# EasyEDA Pro project DreamFly.eprj, schematic Schematic2
Board Name: Board2; Create Date: 2024-09-10; Page Name: DreamFly RemoteControl; Project Name: DreamFly; Schematic Name: Schematic2; Update Date: 2024-12-20; Company: 嘉立创EDA; Drawed: 梅雨; Page Size: A4; Version: V1.0
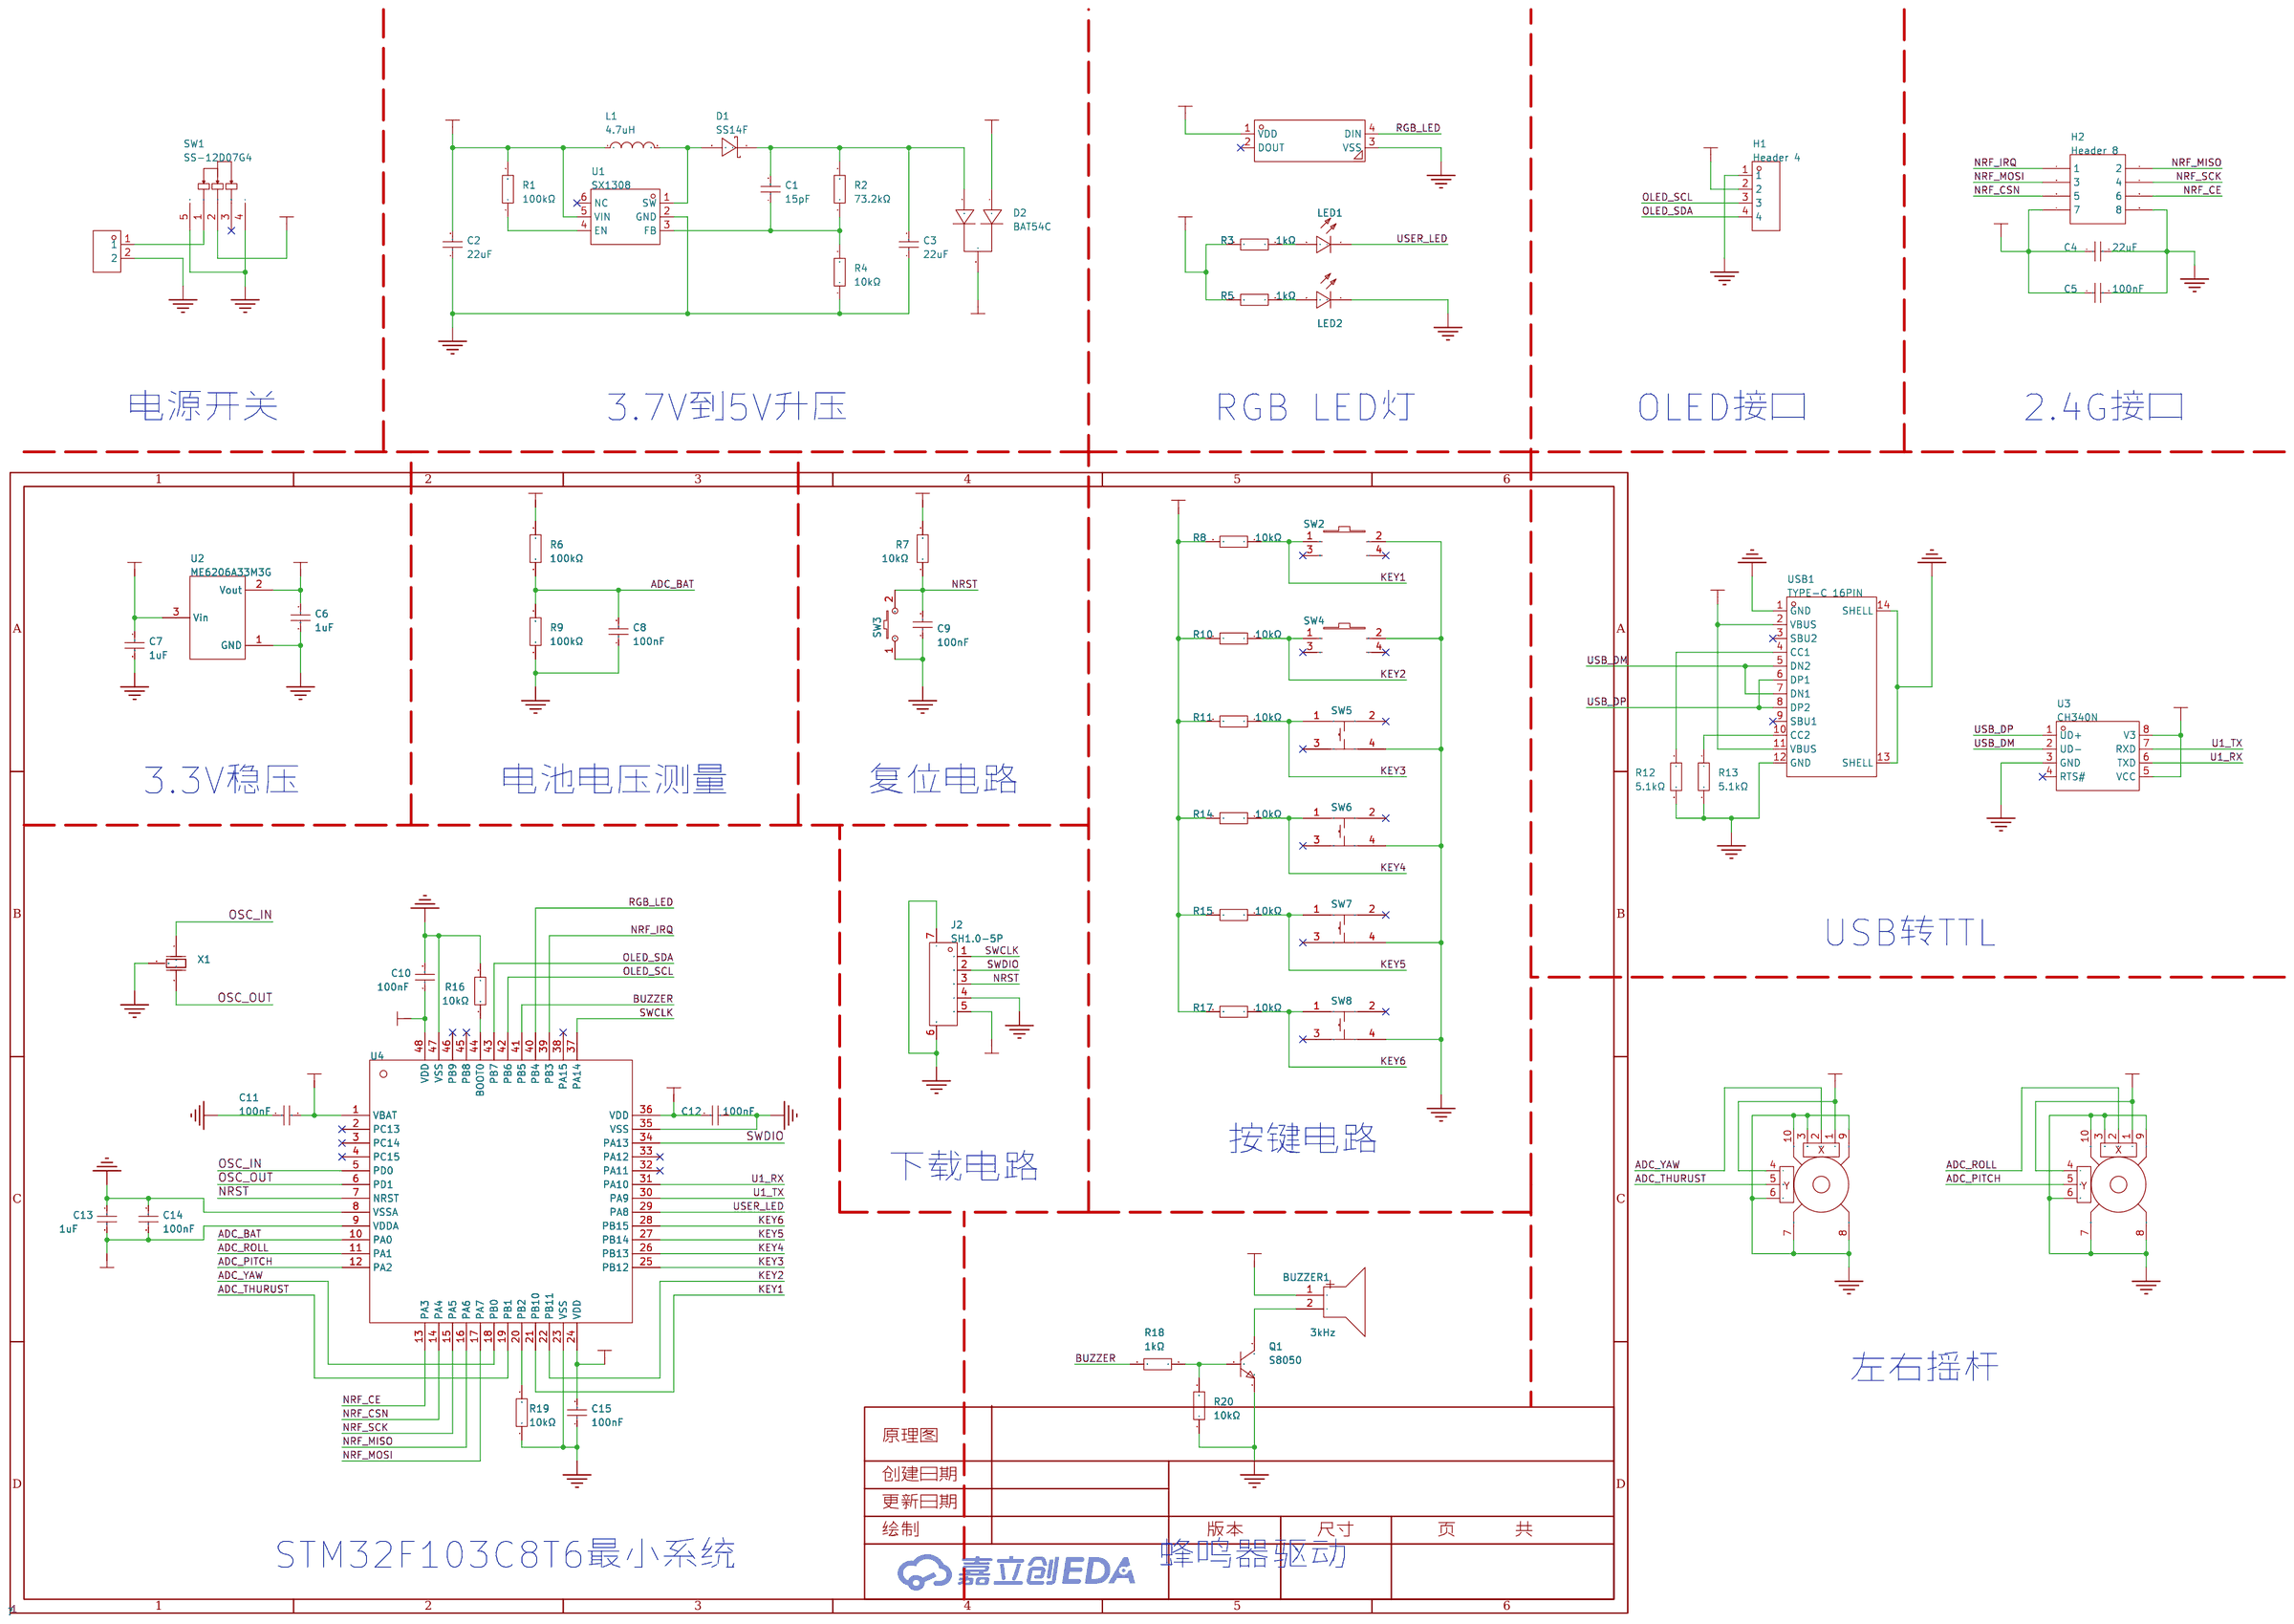
[diagram p1: schematic sheet]

## Parts
BUZZER1  3kHz  [BUZ-TH_BD9.0-P5.00-D0.6-FD]
C1  15pF  [C0603]
C2  22uF  [C0603]
C3  22uF  [C0603]
C4  22uF  [C0603]
C5  100nF  [C0603]
C6  1uF  [C0603]
C7  1uF  [C0603]
C8  100nF  [C0603]
C9  100nF  [C0603]
C10  100nF  [C0603]
C11  100nF  [C0603]
C12  100nF  [C0603]
C13  1uF  [C0603]
C14  100nF  [C0603]
C15  100nF  [C0603]
D1  SS14F  [SMAF_L3.5-W2.6-LS4.7-RD]
D2  BAT54C  [SOT-23-3_L2.9-W1.6-P1.90-LS2.8-BR]
H1  Header 4  [HDR-TH_4P-P2.54-V-F]
H2  Header 8  [HDR-TH_8P-P2.54-V-F-R2-C4-S2.54]
J1  BAT  [BAT]
J2  SH1.0-5P  [CONN-SMD_5P-P1.00_BX-SH1.0-5PWT]
L1  4.7uH  [IND-SMD_L4.9-W4.4_MAPM0420F]
LED1  NCD0603B1  [LED0603-RD]
LED2  NCD0603R1  [LED0603-RD_RED]
Q1  S8050  [SOT-23-3_L2.9-W1.6-P1.90-LS2.8-BR]
R1  100kΩ  [R0603]
R2  73.2kΩ  [R0603]
R3  1kΩ  [R0603]
R4  10kΩ  [R0603]
R5  1kΩ  [R0603]
R6  100kΩ  [R0603]
R7  10kΩ  [R0603]
R8  10kΩ  [R0603]
R9  100kΩ  [R0603]
R10  10kΩ  [R0603]
R11  10kΩ  [R0603]
R12  5.1kΩ  [R0603]
R13  5.1kΩ  [R0603]
R14  10kΩ  [R0603]
R15  10kΩ  [R0603]
R16  10kΩ  [R0603]
R17  10kΩ  [R0603]
R18  1kΩ  [R0603]
R19  10kΩ  [R0603]
R20  10kΩ  [R0603]
RGB1  WS2812B  [LED-SMD_4P-L5.0-W5.0-BL_TC5050RGB]
RP1  LEFT  [RP-TH-LEFT]
RP2  RIGHT  [rp-th-right]
SW1  SS-12D07G4  [SW-TH_DEALON_SS-12D02-VGX]
SW2  TS-1093A-A5B3-D2  [KEY-TH_4P-L7.1-W8.9-P4.50-LS2.5]
SW3  TS-1101S-C-B-B-B-A  [SW-SMD_L6.0-W3.5-LS8.0]
SW4  TS-1093A-A5B3-D2  [KEY-TH_4P-L7.1-W8.9-P4.50-LS2.5]
SW5  TS-1002S-06026C  [KEY-SMD_4P-L6.0-W6.0-P4.50-LS9.5-BR]
SW6  TS-1002S-06026C  [KEY-SMD_4P-L6.0-W6.0-P4.50-LS9.5-BR]
SW7  TS-1002S-06026C  [KEY-SMD_4P-L6.0-W6.0-P4.50-LS9.5-BR]
SW8  TS-1002S-06026C  [KEY-SMD_4P-L6.0-W6.0-P4.50-LS9.5-BR]
U1  SX1308  [SOT-23-6_L2.9-W1.6-P0.95-LS2.8-BL]
U2  ME6206A33M3G  [SOT-23-3_L2.9-W1.6-P1.90-LS2.8-BR]
U3  CH340N  [SOP-8_L4.9-W3.9-P1.27-LS6.0-BL]
U4  STM32F103C8T6  [lqfp-48_l7.0-w7.0-p0.50-ls9.0-bl]
USB1  TYPE-C 16PIN  [USB-C-SMD_TYPE-C-6PIN-2MD-073]
X1  8MHz  [OSC-SMD_3P-L3.2-W1.3-P1.20-L]

## Library data of the parts
BUZZER1 = HNB09A03: 驱动方式:有源(内含驱动线路);构造类型:电磁式;频率:3kHz;声压(SPL):85dB@10cm;; LCSC Part Name: 电磁式有源一体蜂鸣器HNB09A03; Supplier Part: C96102; Manufacturer: 华能; Supplier Footprint: 插件,D=9mm; JLCPCB Part Class: 扩展库; Datasheet: https://atta.szlcsc.com/upload/public/pdf/source/20170522/1495448326172.pdf; Supplier: LCSC; Oscillator Circuit: 有源(内含驱动线路); Technology Type: 电磁式; Operating Voltage: 1.5V~4.5V; Current Consumption: 30mA; Sound Pressure Level (SPL): 85dB@10cm; Diameter (φD): 9mm; Height: 5.5mm; Operating Temperature: -20℃~+70℃
C1 = CL10C150JB8NNNC: 容值:15pF;精度:±5%;额定电压:50V;材质(温度系数):C0G;; LCSC Part Name: 15pF ±5% 50V; Supplier Part: C1644; Manufacturer: SAMSUNG(三星); Supplier Footprint: 0603; JLCPCB Part Class: Basic Part; Datasheet: https://atta.szlcsc.com/upload/public/pdf/source/20160218/1457707763339.pdf; Supplier: LCSC; Tolerance: ±5%; Voltage Rated: 50V; Temperature Coefficient: C0G
C2 C3 = CL10A226MP8NUNE: 容值:22uF;精度:±20%;额定电压:10V;材质(温度系数):X5R;; LCSC Part Name: 22uF ±20% 10V; Supplier Part: C86295; Manufacturer: SAMSUNG(三星); Supplier Footprint: 0603; JLCPCB Part Class: Extended Part; Datasheet: https://atta.szlcsc.com/upload/public/pdf/source/20160218/1457707763339.pdf; Supplier: LCSC; Tolerance: ±20%; Voltage Rated: 10V; Temperature Coefficient: X5R
C4 C5 C8 C10-C15 = CL10B104KB8NNNC: 容值:100nF;精度:±10%;额定电压:50V;材质(温度系数):X7R;; LCSC Part Name: 100nF ±10% 50V; Supplier Part: C1591; Manufacturer: SAMSUNG(三星); Supplier Footprint: 0603; JLCPCB Part Class: Extended Part; Datasheet: https://atta.szlcsc.com/upload/public/pdf/source/20160218/1457707763339.pdf; Supplier: LCSC; Tolerance: ±10%; Voltage Rated: 50V; Temperature Coefficient: X7R
C6 C7 = CL10A105KB8NNNC: 容值:1uF;精度:±10%;额定电压:50V;材质(温度系数):X5R;; LCSC Part Name: 1uF ±10% 50V; Supplier Part: C15849; Manufacturer: SAMSUNG(三星); Supplier Footprint: 0603; JLCPCB Part Class: Basic Part; Datasheet: https://atta.szlcsc.com/upload/public/pdf/source/20160218/1457707763339.pdf; Supplier: LCSC; Tolerance: ±10%; Voltage Rated: 50V; Temperature Coefficient: X5R
C9 = CL10A475KP8NNNC: 容值:4.7uF;精度:±10%;额定电压:10V;材质(温度系数):X5R;; LCSC Part Name: 4.7uF ±10% 10V; Supplier Part: C1705; Manufacturer: SAMSUNG(三星); Supplier Footprint: 0603; JLCPCB Part Class: Extended Part; Datasheet: https://atta.szlcsc.com/upload/public/pdf/source/20160218/1457707763339.pdf; Supplier: LCSC; Tolerance: ±10%; Voltage Rated: 10V; Temperature Coefficient: X5R
D1 = SS14F_C64880: 正向压降(Vf):550mV@1A;直流反向耐压(Vr):40V;平均整流电流(Io):1A;; LCSC Part Name: 电压:40V 电流:1A; Supplier Part: C64880; Manufacturer: MDD; Supplier Footprint: SMAF; JLCPCB Part Class: 扩展库; Datasheet: https://atta.szlcsc.com/upload/public/pdf/source/20230823/E8EB324D9FAAE659A2B5393973A101D8.pdf; Supplier: LCSC; Forward Voltage (Vf@If): 550mV@1A; Reverse Voltage (Vr): 40V; Average Rectified Current (Io): 1A
D2 = BAT54C_C2135: LCSC Part Name: 电压:30V 电流:200mA; Supplier Part: C2135; Manufacturer: CJ(江苏长电/长晶); Supplier Footprint: SOT-23; JLCPCB Part Class: 扩展库; Datasheet: https://atta.szlcsc.com/upload/public/pdf/source/20140809/1457707206468.pdf; Supplier: LCSC; Forward Voltage (Vf@If): 1V@100mA; Reverse Voltage (Vr): 30V; Average Rectified Current (Io): 200mA
H1 = 2.54-1*4P母: 插孔结构:1x4P;间距:2.54mm;行距:-;圆孔/方孔:方孔;安装类型:直插;排数:单排;总孔位数:4P;额定电流:3A;额定电压:-;插孔方向:顶部;塑高:-;触头材质:青铜;触头镀层:-;工作温度范围:-40℃~+105℃;焊接温度(最大值):-;; LCSC Part Name: 间距:2.54mm 1x4P 直插; Supplier Part: C2718488; Manufacturer: BOOMELE(博穆精密); Supplier Footprint: 插件,P=2.54mm; JLCPCB Part Class: 扩展库; Datasheet: https://atta.szlcsc.com/upload/public/pdf/source/20210301/C2718488_F4427B881E42CAA8DDB0B1C12B3A522C.pdf; Supplier: LCSC; Holes Structure: 1x4P; Pitch: 2.54mm; Circular Hole / Square Hole: 方孔; Mounting Type: 直插; Number of Rows: 单排; Number of Holes: 4P; Current Rating (Max): 3A; Holes Direction: 顶部; Contact Material: 青铜; Operating Temperature Range: -40℃~+105℃
H2 = DS1023-2*4SF11: 插孔结构:2x4P;间距:2.54mm;行距:2.54mm;安装类型:直插;排数:双排;总孔位数:8P;塑高:-;触头材质:-;触头镀层:-;; LCSC Part Name: 间距:2.54mm 2x4P 直插 黑色; Supplier Part: C92271; Manufacturer: CONNFLY; Supplier Footprint: 插件,P=2.54mm; JLCPCB Part Class: 扩展库; Datasheet: https://atta.szlcsc.com/upload/public/pdf/source/20170925/C132132_1506321659018990428.pdf; Supplier: LCSC; Holes Structure: 2x4P; Pitch: 2.54mm; Row Spacing: 2.54mm; Mounting Type: 直插; Number of Rows: 双排; Number of Holes: 8P
J1 = BAT
J2 = BX-SH1.0-5PWT: 插针结构:1x5P;间距:1mm;安装方式:卧贴;参考系列:SH;总PIN数:5P;排数:1;每排PIN数:5;行距:-;额定电流:1A;触头材质:黄铜;触头镀层:锡;工作温度范围:-25℃~+85℃;; Supplier Part: C18077911; Manufacturer: Bossie(博锡); Supplier Footprint: SMD,P=1mm,卧贴; JLCPCB Part Class: Extended Part; Datasheet: https://atta.szlcsc.com/upload/public/pdf/source/20231017/4CDB0A212BD50B56D4BC69924E3F273B.pdf; Supplier: LCSC; Pins Structure: 1x5P; Pitch: 1mm; Mounting Style: 卧贴; Reference Series: SH; Number of Pins: 5P; Number of Rows: 1; Number of PINs Per Row: 5; Current Rating (Max): 1A; Contact Material: 黄铜; Contact Plating: 锡; Operating Temperature Range: -25℃~+85℃
L1 = HA42-4R7MT: LCSC Part Name: 4.7uH ±20% 3A; Supplier Part: C2936653; Manufacturer: FH(风华); Supplier Footprint: 0420; JLCPCB Part Class: 扩展库; Datasheet: https://atta.szlcsc.com/upload/public/pdf/source/20211228/DF5AAD1C624D1DACD739A51BD94418BC.pdf; Supplier: LCSC; Tolerance: ±20%; Rated Current: 2A; Saturation Current (Isat): 3A; DC Resistance (DCR): 150mΩ
LED1 = NCD0603B1: 发光颜色:蓝色;正向电压(VF):2.6V~3.6V;功率:72mW;正向电流:10mA;主波长:463nm~475nm;透镜颜色:无色透明透镜;发光强度:80mcd~220mcd;发光角度:130°;工作温度:-30℃~+85℃;; Supplier Part: C84266; Manufacturer: 国星光电; Supplier Footprint: 0603; JLCPCB Part Class: 扩展库; Datasheet: https://atta.szlcsc.com/upload/public/pdf/source/20200820/C84266_6A3CDBEFA72C6CAD68EDA53474ADAE6C.pdf; Supplier: LCSC; Emitted Color: 蓝色; Forward Voltage (VF): 2.6V~3.6V; Power Dissipation: 72mW; Forward Current: 10mA; Dominant Wavelength: 463nm~475nm; Lens Color: 无色透明透镜; Luminous Intensity: 80mcd~220mcd; Viewing Angle: 130°; Operating Temperature: -30℃~+85℃
LED2 = NCD0603R1_C84263: 灯头类型:-;发光颜色:红色;正向电压(VF):1.6V~2.6V;功率:65mW;正向电流:20mA;主波长:615nm~630nm;二极管配置:独立二极管;透镜颜色:无色透明透镜;色温:-;发光强度:80mcd~220mcd;发光角度:130°;载带方式:-;工作温度:-30℃~+85℃;; Supplier Part: C84263; Manufacturer: 国星光电; Supplier Footprint: 0603; JLCPCB Part Class: 扩展库; Datasheet: https://atta.szlcsc.com/upload/public/pdf/source/20200820/C84263_DABC6A75E58F576973B407FDBA283D60.pdf; Supplier: LCSC; Emitted Color: 红色; Forward Voltage (VF): 1.6V~2.6V; Power Dissipation: 65mW; Forward Current: 20mA; Dominant Wavelength: 615nm~630nm; Diode Configuration: 独立二极管; Lens Color: 无色透明透镜; Luminous Intensity: 80mcd~220mcd; Viewing Angle: 130°; Operating Temperature: -30℃~+85℃
Q1 = S8050_C181158: LCSC Part Name: NPN 电流:500mA 耐压:25V; Supplier Part: C181158; Manufacturer: Hottech(合科泰); Supplier Footprint: SOT-23; JLCPCB Part Class: 扩展库; Datasheet: https://atta.szlcsc.com/upload/public/pdf/source/20220506/D987F39D56F2975D34EC7947E75C4ABC.pdf; Supplier: LCSC; Transistor Type: NPN; Collector Current (Ic): 500mA; Collector-Emitter Breakdown Voltage (Vceo): 25V; Power Dissipation (Pd): 300mW; Transition Frequency (fT): 150MHz; Collector Cut-Off Current (Icbo): 100nA; Collector-Emitter Saturation Voltage (VCE(sat)@Ic,Ib): 600mV@500mA,50mA
R1 R6 R9 = 0603WAF1003T5E: 电阻类型:厚膜电阻;阻值:100kΩ;精度:±1%;功率:100mW;最大工作电压:75V;温度系数:±100ppm/℃;; LCSC Part Name: 100kΩ ±1% 100mW 厚膜电阻; Supplier Part: C25803; Manufacturer: UNI-ROYAL(厚声); Supplier Footprint: 0603; JLCPCB Part Class: Basic Part; Datasheet: https://atta.szlcsc.com/upload/public/pdf/source/20200306/C422600_1E6D84923E4A46A82E41ADD87F860B5C.pdf; Supplier: LCSC; Type: 厚膜电阻; Tolerance: ±1%; Power(Watts): 100mW; Overload Voltage (Max): 75V; Temperature Coefficient: ±100ppm/℃; Operating Temperature Range: -55℃~+155℃
R2 = 0603WAF7322T5E: 电阻类型:厚膜电阻;阻值:73.2kΩ;精度:±1%;功率:100mW;最大工作电压:75V;温度系数:±100ppm/℃;; LCSC Part Name: 73.2kΩ ±1% 100mW 厚膜电阻; Supplier Part: C14890; Manufacturer: UNI-ROYAL(厚声); Supplier Footprint: 0603; JLCPCB Part Class: Extended Part; Datasheet: https://atta.szlcsc.com/upload/public/pdf/source/20200306/C422600_1E6D84923E4A46A82E41ADD87F860B5C.pdf; Supplier: LCSC; Type: 厚膜电阻; Tolerance: ±1%; Power(Watts): 100mW; Overload Voltage (Max): 75V; Temperature Coefficient: ±100ppm/℃; Operating Temperature Range: -55℃~+155℃
R3 R5 R18 R20 = 0603WAF1001T5E: 电阻类型:厚膜电阻;阻值:1kΩ;精度:±1%;功率:100mW;最大工作电压:75V;温度系数:±100ppm/℃;; LCSC Part Name: 1kΩ ±1% 100mW 厚膜电阻; Supplier Part: C21190; Manufacturer: UNI-ROYAL(厚声); Supplier Footprint: 0603; JLCPCB Part Class: 基础库; Datasheet: https://atta.szlcsc.com/upload/public/pdf/source/20200306/C422600_1E6D84923E4A46A82E41ADD87F860B5C.pdf; Supplier: LCSC; Type: 厚膜电阻; Tolerance: ±1%; Power(Watts): 100mW; Overload Voltage (Max): 75V; Temperature Coefficient: ±100ppm/℃; Operating Temperature Range: -55℃~+155℃
R4 R7 R8 R10-R17 R19 = 0603WAF1002T5E: 电阻类型:厚膜电阻;阻值:10kΩ;精度:±1%;功率:100mW;最大工作电压:75V;温度系数:±100ppm/℃;; LCSC Part Name: 厚膜电阻 10kΩ ±1% 100mW; Supplier Part: C25804; Manufacturer: UNI-ROYAL(厚声); Supplier Footprint: 0603; JLCPCB Part Class: Basic Part; Datasheet: https://atta.szlcsc.com/upload/public/pdf/source/20200306/C422600_1E6D84923E4A46A82E41ADD87F860B5C.pdf; Supplier: LCSC; Type: 厚膜电阻; Tolerance: ±1%; Power(Watts): 100mW; Overload Voltage (Max): 75V; Temperature Coefficient: ±100ppm/℃; Operating Temperature Range: -55℃~+155℃
RGB1 = WS2812B-B/W: 黑支架，适合黑色结构产品（注意防潮，请查阅规格书中对应具体内容）; LCSC Part Name: RGB三色; Manufacturer: worldsemi; Supplier Footprint: SMD5050; JLCPCB Part Class: 扩展库; Datasheet: https://atta.szlcsc.com/upload/public/pdf/source/20200615/C114586_26EB6813EC9F2A3F6C7FBB2AD75DE01F.pdf
RP1 = Rocker Potentiometer Left
RP2 = Rocker Potentiometer Right
SW1 = SS-12D07G4: LCSC Part Name: 拨动开关单排两档高度4; Supplier Part: C7471827; Manufacturer: HanElectricity(瀚源); JLCPCB Part Class: 扩展库; Datasheet: https://atta.szlcsc.com/upload/public/pdf/source/20230804/8F380914F6D2310095340BEFBA1166E2.pdf; Supplier: LCSC
SW2 SW4 = TS-1093A-A5B3-D2: 电路结构:单刀单掷;按钮形状:圆形按钮;安装方式:卧插;开关长度:6mm;开关宽度:6mm;开关高度:6mm;带灯:-;机械寿命:-;; LCSC Part Name: 6*6*6mm 卧插 轻触开关; Supplier Part: C499312; Manufacturer: Yuandi(元迪); Supplier Footprint: 插件,6x6mm; JLCPCB Part Class: 扩展库; Datasheet: https://atta.szlcsc.com/upload/public/pdf/source/20200318/C499316_15EE3C9E166639245C74A0C559E04CF4.pdf; Supplier: LCSC; Circuit: 单刀单掷; Actuator Style: 圆形按钮; Mounting Style: 卧插; Switch Length: 6mm; Switch Width: 6mm; Switch Height: 6mm
SW3 = TS-1101S-C-B-B-B-A: 电路结构:单刀单掷;按钮形状:矩形按钮;作用力:260gf;安装方式:立贴;开关长度:6mm;开关宽度:3.5mm;开关高度:5mm;带支架:不带;触点电流:50mA;额定电压(DC):12V;绝缘电阻:-;带灯:无;机械寿命:5万次;; LCSC Part Name: 6*3.5*5mm 立贴 轻触开关; Supplier Part: C609852; Manufacturer: XKB Connectivity(中国星坤); Supplier Footprint: SMD; JLCPCB Part Class: 扩展库; Datasheet: https://atta.szlcsc.com/upload/public/pdf/source/20211011/FB5BEC18F2E7B990941A3F47A2FD4F18.pdf; Supplier: LCSC; Circuit: 单刀单掷; Actuator Style: 矩形按钮; Operating Force: 260gf; Mounting Style: 立贴; Switch Length: 6mm; Switch Width: 3.5mm; Switch Height: 5mm; Strike Gundam: 不带; Contact Current: 50mA; Voltage Rating (DC): 12V; Actuator/Cap Color: 黑色; With Lamp: 无; Mechanical Life: 5万次; Operating Temperature: -20℃~+70℃
SW5-SW8 = TS-1002S-06026C: 电路结构:单刀单掷;按钮形状:圆形按钮;安装方式:立贴;开关长度:6mm;开关宽度:6mm;开关高度:6mm;触点电流:50mA;额定电压(DC):12V;带灯:-;机械寿命:-;; LCSC Part Name: 6*6*6mm 立贴 轻触开关; Supplier Part: C455112; Manufacturer: XUNPU(讯普); Supplier Footprint: SMD,6x6mm; JLCPCB Part Class: 扩展库; Datasheet: https://atta.szlcsc.com/upload/public/pdf/source/20191118/C455126_F61E8FA1ED640FB1CE0B30B55DEB62E3.pdf; Supplier: LCSC; Circuit: 单刀单掷; Actuator Style: 圆形按钮; Mounting Style: 立贴; Switch Length: 6mm; Switch Width: 6mm; Switch Height: 6mm; Contact Current: 50mA; Voltage Rating (DC): 12V
U1 = SX1308: 功能类型:升压型;输入电压:2V~24V;输出电压:28V;输出电流(最大值):-;; Supplier Part: C78162; Manufacturer: SX(硕芯科技); Supplier Footprint: SOT-23-6; JLCPCB Part Class: 扩展库; Datasheet: https://atta.szlcsc.com/upload/public/pdf/source/20160920/1474356679185.pdf; Supplier: LCSC; Function: 升压型; Input Voltage: 2V~24V; Output Voltage: 28V; Switching Frequency: 1.2MHz; Synchronous Rectification: 否; Number of Outputs: 1; Topology: 升压式; Switch tube (built-in/external): 内置
U2 = ME6206A33M3G: 输出类型:固定;最大输入电压:6V;输出电压:3.3V;最大输出电流:300mA;电源纹波抑制比(PSRR):50dB@(1kHz);输出极性:正极;; LCSC Part Name: 输入6V 输出3.3V 300mA; Supplier Part: C35259; Manufacturer: MICRONE(南京微盟); Supplier Footprint: SOT-23-3L; JLCPCB Part Class: 扩展库; Datasheet: https://atta.szlcsc.com/upload/public/pdf/source/20160727/1469591428238.pdf; Supplier: LCSC; Output Type: 固定; Maximum Input Voltage: 6V; Output Voltage: 3.3V; MAX Output Current: 300mA; Power Supply Rejection Ratio (PSRR): 50dB@(1kHz); Dropout Voltage: 380mV@(200mA); Output Polarity: 正极; Number of Outputs: 1
U3 = CH340N: LCSC Part Name: USB转串口芯片 CH340; Supplier Part: C2977777; Manufacturer: WCH(南京沁恒); Supplier Footprint: SOP-8; JLCPCB Part Class: 扩展库; Datasheet: https://atta.szlcsc.com/upload/public/pdf/source/20230530/6E401E9554E9F5311886CC8B3F89B62E.pdf; Supplier: LCSC
U4 = STM32F103C8T6: LCSC Part Name: 主流增强型ARM Cortex-M3 MCU，具有64 KB Flash、72 MHz CPU、电机控制、USB和CAN; Supplier Part: C8734; Manufacturer: ST(意法半导体); Supplier Footprint: LQFP-48(7x7); JLCPCB Part Class: Extended Part; Datasheet: https://atta.szlcsc.com/upload/public/pdf/source/20220812/8363ACEC51AD55ECEB84799464F7CB85.pdf; Supplier: LCSC; CPU Core: ARM-M3; Program Storage Size: 64KB; RAM Size: 20KB; GPIO Ports Number: 37; Operating Voltage Range: 2V~3.6V; CPU Maximum Speed: 72MHz; Program Memory Type: FLASH; Operating Temperature Range: -40℃~+85℃; ADC (Bit): 12bit; Universal Serial Bus: 有; Peripheral/Function: 看门狗；DMA；看门狗；温度传感器; Watchdog: 有; Infrared Data Association: 有; Low-Voltage Detect: 有; Direct Memory Access: 有; Internal Oscillator: 有
USB1 = TYPE-C 16PIN 2MD(073): 连接器类型:Type-C;标准:-;公母:母;端口数量:1;触点数量:16P;安装方式:卧贴;额定电流 - 电源:5A;工作温度范围:-25℃~+85℃;; LCSC Part Name: Type-C 母 卧贴; Supplier Part: C2765186; Manufacturer: SHOU HAN(首韩); Supplier Footprint: SMD; JLCPCB Part Class: 扩展库; Datasheet: https://atta.szlcsc.com/upload/public/pdf/source/20211123/39B17C16241EAC15C5E277BDA434118E.pdf; Supplier: LCSC; Connector Type: Type-C; Gender: 母; Number of Ports: 1; Number of Contacts: 16P; Mounting Style: 卧贴; Current Rating - Power (Max): 5A; Operating Temperature Range: -25℃~+85℃
X1 = CSTNE8M00GH5C000R0: 频率:8MHz;内置负载电容:33pF;谐振阻抗:40Ω;; LCSC Part Name: 8MHz ±0.07% 内置负载电容:33pF; Supplier Part: C341525; Manufacturer: muRata(村田); Supplier Footprint: SMD3213-3P; JLCPCB Part Class: 扩展库; Datasheet: https://atta.szlcsc.com/upload/public/pdf/source/20181211/C341525_832BA077079E4863A5153C1DB98581D5.pdf; Supplier: LCSC; Built-in Load Capacitance: 33pF; Resonant Impedance: 40Ω; Operating Temperature: -40℃~+125℃

## Nets
3V3: BUZZER1.1(+) C4.1 C5.1 C6.1 C10.1 C11.2 C12.1 C13.2 C14.2 C15.2 H1.2 H2.7 J2.5 R3.2 R5.2 R7.2 R8.2 R10.2 R11.2 R14.2 R15.2 R17.2 RP1.1(A) RP1.4(A) RP2.1(A) RP2.4(A) U2.2(Vout) U3.5(VCC) U3.8(V3) U4.1(VBAT) U4.9(VDDA) U4.24(VDD) U4.36(VDD) U4.48(VDD)
5V: C7.1 D2.3(K) RGB1.1(VDD) U2.3(Vin)
GND: C2.1 C3.1 C4.2 C5.2 C6.2 C7.2 C8.1 C9.2 C10.2 C11.1 C12.2 C13.1 C14.1 C15.1 H1.1 H2.8 J1.2 J2.4 J2.6 J2.7 LED2.1(K) Q1.2 R4.1 R9.2 R12.2 R13.2 R16.1 R19.1 R20.1 RGB1.3(VSS) RP1.3(B) RP1.6(B) RP1.7(GND) RP1.8(GND) RP1.9(GND) RP1.10(GND) RP2.3(B) RP2.6(B) RP2.7(GND) RP2.8(GND) RP2.9(GND) RP2.10(GND) SW1.4 SW1.5 SW2.2 SW3.1 SW4.2 SW5.4 SW6.4 SW7.4 SW8.4 U1.2(GND) U2.1(GND) U3.3(GND) U4.8(VSSA) U4.23(VSS) U4.35(VSS) U4.47(VSS) USB1.1(GND) USB1.12(GND) USB1.13(SHELL) USB1.14(SHELL) X1.2(GND)
VBAT: C2.2 L1.1 R1.2 R6.1 SW1.2 U1.5(VIN)
VBUS: D2.1(A1) USB1.2(VBUS) USB1.11(VBUS)
ADC_BAT: C8.2 R6.2 R9.1 U4.10(PA0)
ADC_PITCH: RP2.5(DTA) U4.12(PA2)
ADC_ROLL: RP2.2(DTA) U4.11(PA1)
ADC_THURUST: RP1.5(DTA) U4.19(PB1)
ADC_YAW: RP1.2(DTA) U4.18(PB0)
BUZZER: R18.2 U4.41(PB5)
KEY1: R8.1 SW2.1 U4.21(PB10)
KEY2: R10.1 SW4.1 U4.22(PB11)
KEY3: R11.1 SW5.1 U4.25(PB12)
KEY4: R14.1 SW6.1 U4.26(PB13)
KEY5: R15.1 SW7.1 U4.27(PB14)
KEY6: R17.1 SW8.1 U4.28(PB15)
NRF_CE: H2.6 U4.13(PA3)
NRF_CSN: H2.5 U4.14(PA4)
NRF_IRQ: H2.1 U4.39(PB3)
NRF_MISO: H2.2 U4.16(PA6)
NRF_MOSI: H2.3 U4.17(PA7)
NRF_SCK: H2.4 U4.15(PA5)
NRST: C9.1 J2.3 R7.1 SW3.2 U4.7(NRST)
OLED_SCL: H1.3 U4.42(PB6)
OLED_SDA: H1.4 U4.43(PB7)
OSC_IN: U4.5(PD0) X1.1(OSC1)
OSC_OUT: U4.6(PD1) X1.3(OSC2)
RGB_LED: RGB1.4(DIN) U4.40(PB4)
SWCLK: J2.1 U4.37(PA14)
SWDIO: J2.2 U4.34(PA13)
U1_RX: U3.6(TXD) U4.31(PA10)
U1_TX: U3.7(RXD) U4.30(PA9)
USB_DM: U3.2(UD-) USB1.5(DN2) USB1.7(DN1)
USB_DP: U3.1(UD+) USB1.6(DP1) USB1.8(DP2)
USER_LED: LED1.1(-) U4.29(PA8)
$1N4079: LED2.2(A) R5.1
$1N4080: LED1.2(+) R3.1
$1N4159: R16.2 U4.44(BOOT0)
$1N4196: C1.1 R2.1 R4.2 U1.3(FB)
$1N4197: D1.2(A) L1.2 U1.1(SW)
$1N4198: R1.1 U1.4(EN)
$1N4201: C1.2 C3.2 D1.1(K) D2.2(A2) R2.2
$1N4533: BUZZER1.2(-) Q1.3
$1N4621: Q1.1 R18.1 R20.2
$1N6920: R19.2 U4.20(PB2)
$1N17164: J1.1 SW1.1
$1N35382: R13.1 USB1.10(CC2)
$1N35388: R12.1 USB1.4(CC1)

Not connected (* = marked no-connect by the designer): RGB1 2(DOUT)*; SW1 3*; SW2 3* 4*; SW4 3* 4*; SW5 2* 3*; SW6 2* 3*; SW7 2* 3*; SW8 2* 3*; U1 6(NC)*; U3 4(RTS#)*; U4 2(PC13)* 3(PC14)* 4(PC15)* 32(PA11)* 33(PA12)* 38(PA15)* 45(PB8)* 46(PB9)*; USB1 3(SBU2)* 9(SBU1)*

## Notes on the sheet
- 电源开关
- 3.7V到5V升压
- RGB LED灯
- OLED接口
- 2.4G接口
- 3.3V稳压
- 电池电压测量
- 复位电路
- USB转TTL
- 按键电路
- 下载电路
- 左右摇杆
- STM32F103C8T6最小系统
- 蜂鸣器驱动
